# EAGLE design usb_cable_tester (EAGLE 7.7.0)
CNAME: USB Cable Tester (Aroerina2 Mod); CREVISION: 0.1; DESIGNER: drubicza
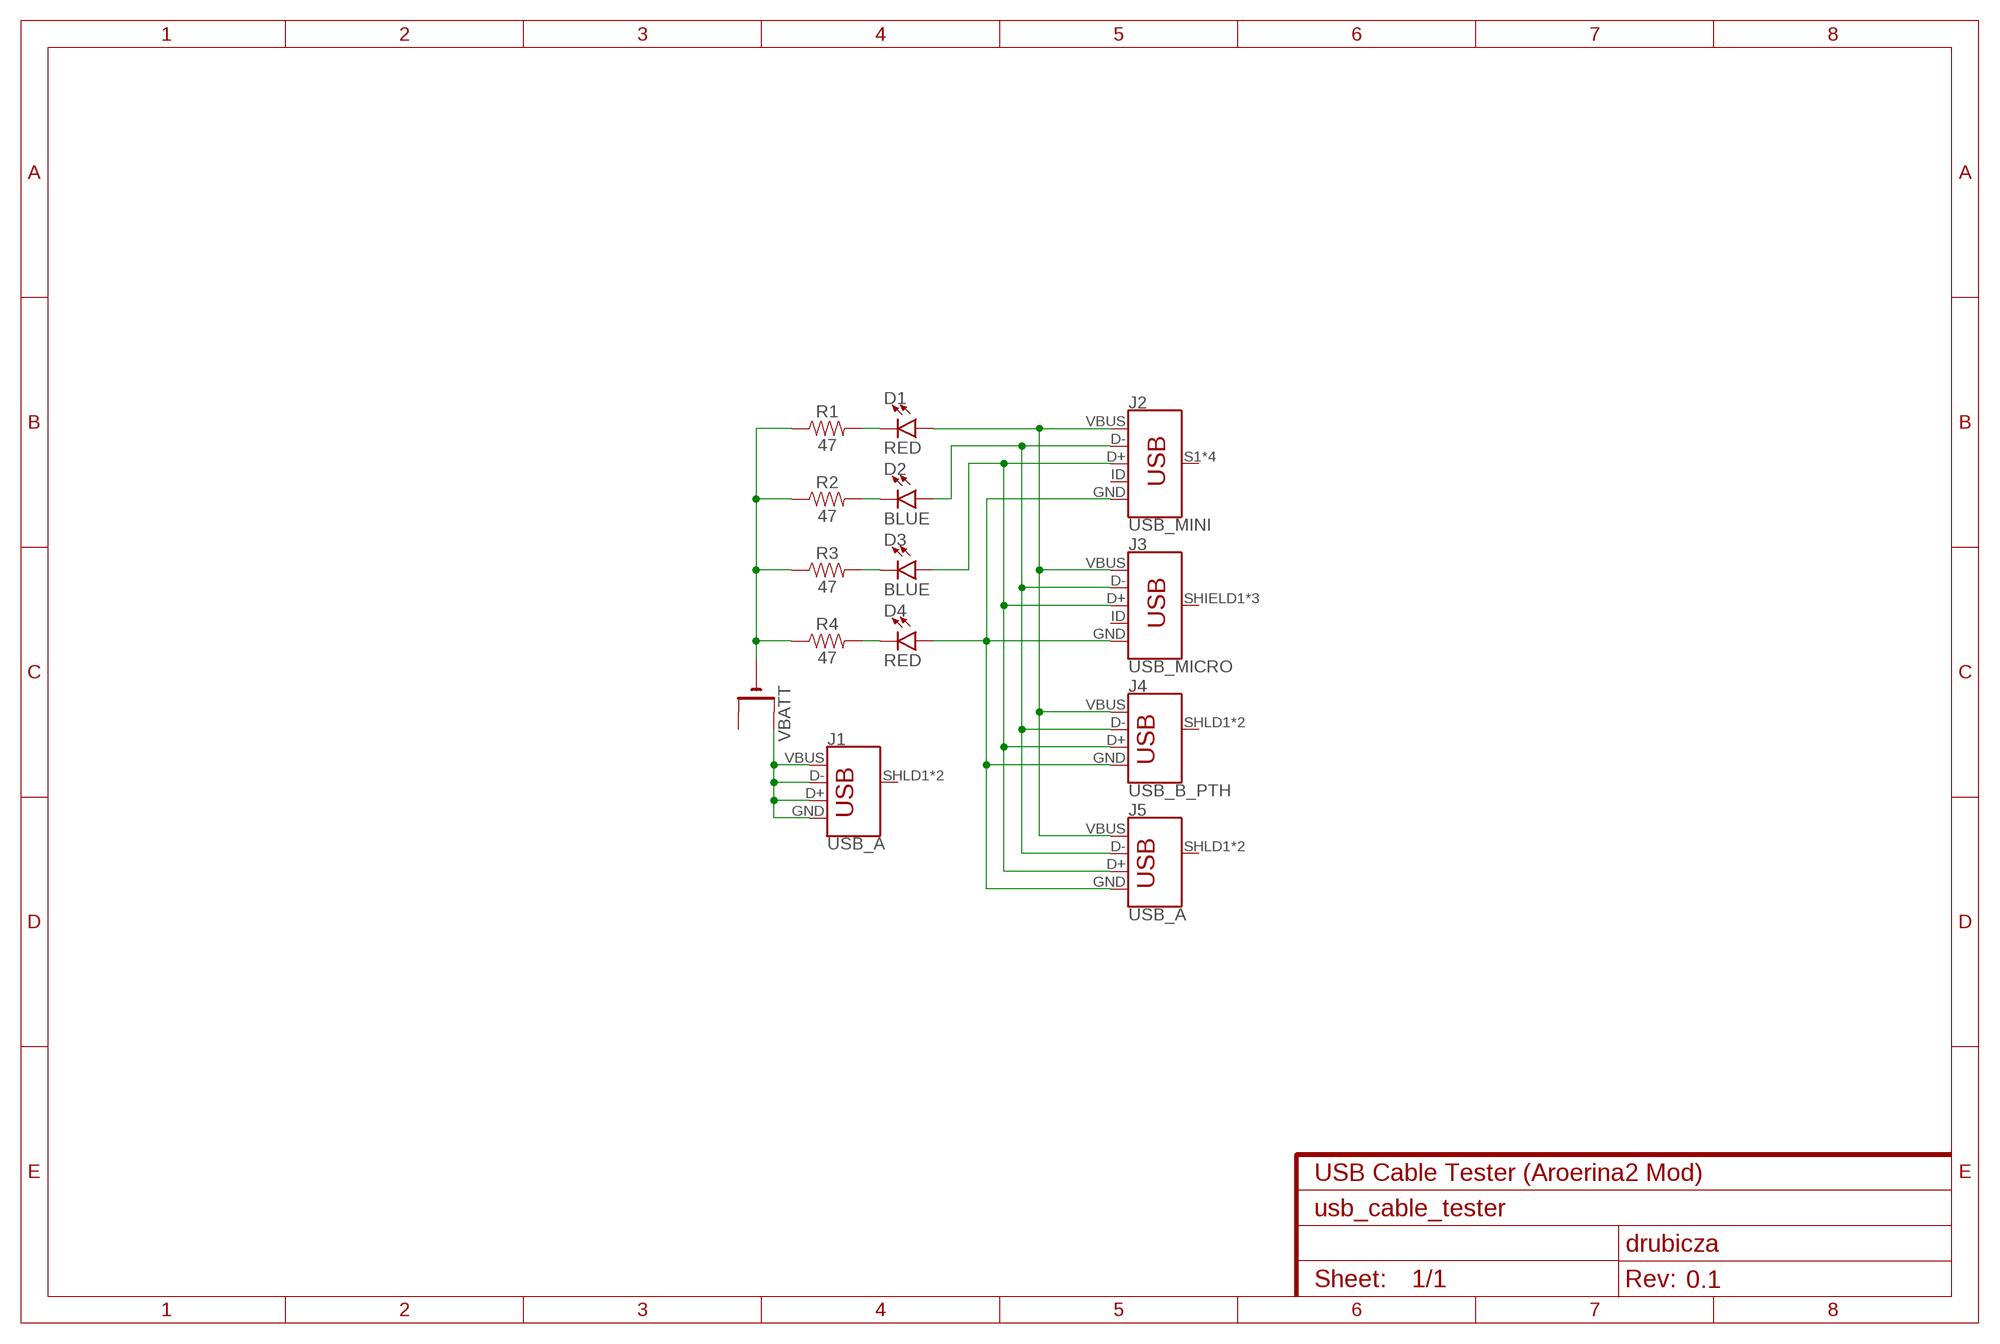
[diagram p0: schematic, sheet 1]

## Parts
D1  RED  LED-RED0603  [LED-0603]
D2  BLUE  LED-BLUE0603  [LED-0603]
D3  BLUE  LED-BLUE0603  [LED-0603]
D4  RED  LED-RED0603  [LED-0603]
J1  USB_A  USB_A_SMT_FEMALE_NS  [USB-A-S-NOSILK-FEMALE]
J2  USB_MINI  USB_MINI-B_SMT  [USB-MINIB]
J3  USB_MICRO  USB_MICRO-B_FEMALE-SMT  [USB-B-MICRO-SMD]
J4  USB_B_PTH  [USB-B-PTH]
J5  USB_A  USB_A_SMT_FEMALE_NS  [USB-A-S-NOSILK-FEMALE]
R1  47  47KOHM-0603-1/10W-1%  [0603]
R2  47  47KOHM-0603-1/10W-1%  [0603]
R3  47  47KOHM-0603-1/10W-1%  [0603]
R4  47  47KOHM-0603-1/10W-1%  [0603]
VBATT  CR2032SMT  [CR2032-SMD]

## Nets
GND: R1.1 R2.1 R3.1 R4.1 VBATT.-
N$1: D1.C R1.2
N$2: D2.C R2.2
N$3: D3.C R3.2
N$4: D4.C R4.2
N$6: J1.D+ J1.D- J1.GND J1.VBUS VBATT.+$1(+)
N$7: D1.A J2.VBUS J3.VBUS J4.VBUS J5.VBUS
N$8: D2.A J2.D- J3.D- J4.D- J5.D-
N$9: D3.A J2.D+ J3.D+ J4.D+ J5.D+
N$10: D4.A J2.GND J3.GND J4.GND J5.GND
Unconnected: J1.SHLD1(SHIELD) J1.SHLD2(SHIELD) J2.ID J2.S1(SHIELD) J2.S2(SHIELD) J2.S3(SHIELD) J2.S4(SHIELD) J3.ID J3.SHIELD1(SHIELD) J3.SHIELD2(SHIELD) J3.SHIELD3(SHIELD) J4.SHLD1(SHIELD) J4.SHLD2(SHIELD) J5.SHLD1(SHIELD) J5.SHLD2(SHIELD) VBATT.+$2(+1)

## Library data of the parts
D1 D4 = SparkFun-LED:LED-RED: Red SMD LED Used in manufacturing of most products at SparkFun Packages: 0603 - SMD 0603 package [Product Link] <http://docs.avagotech.com/docs/AV02-0551EN> 0603 SMART - SMD 0603 SMART package ( more efficient and expensive)[Product Link] <http://www.osram-os.com/Graphics/XPic2/00077099_0.pdf> 1206 - SMD1206 package [Product Link] <https://www.sparkfun.com/datasheets/DevTools/LilyPad/Q150OVS4.pdff> SparkFun Products: Pro Mini 328 -5V <https://www.sparkfun.com/products/821> RedBoard <https://www.sparkfun.com/products/12757> IOIO-OTG <https://www.sparkfun.com/products/13613>; PROD_ID: DIO-00819
D2 D3 = SparkFun-LED:LED-BLUE: Blue SMD LED Used in manufacturing of various products at SparkFun Packages: 0603 - SMD 0603 package [Product Link] <http://www.digikey.com/product-detail/en/SMLE12BC7TT86/511-1589-2-ND/1641808> 1206 - SMD1206 package [Product Link] <http://www.digikey.com/product-detail/en/lite-on-inc/LTST-C150TBKT/160-1643-1-ND/573584> SparkFun Products: ESP8266 Thing-Dev Board <https://www.sparkfun.com/products/13711> RedBoard <https://www.sparkfun.com/products/12757>; PROD_ID: DIO-08575
J1 J5 = SparkFun-Connectors:USB_A: USB-A Connector Male and female variants, as well as PTH and SMT variants SparkFun Products: SparkFun XBee Explorer Dongle <https://www.sparkfun.com/products/11697> PTH Male SparkFun MicroView-USB Programmer <https://www.sparkfun.com/products/12924> SMT Male SparkFun USB Type A Female Breakout <https://www.sparkfun.com/products/12700> SMT Female; PROD_ID: CONN-09520; SF_ID: PRT-09011
J2 = SparkFun-Connectors:USB_MINI-B: USB type Mini-B Connector Breaks out 5th pin, and includes shield pins if needed. SparkFun Products: SparkFun FTDI Basic Breakout <https://www.sparkfun.com/products/9716> SparkFun XBee Explorer USB <https://www.sparkfun.com/products/11812> SparkFun Redboard <https://www.sparkfun.com/products/12757>; PROD_ID: CONN-08193; SF_ID: PRT-00587
J3 = SparkFun-Connectors:USB_MICRO-B: USB Type Micro-B Connector Male/female and PTH/SMT variants SparkFun Products: SparkFun microB USB Breakout <https://www.sparkfun.com/products/12035> SparkFun USB microB Plug Breakout <https://www.sparkfun.com/products/10031> SparkFun ESP8266 Thing <https://www.sparkfun.com/products/13231>; PROD_ID: CONN-11752
J4 = SparkFun-Connectors:USB_B: USB Type B Connector SparkFun Products: SparkFun Stepoko <https://www.sparkfun.com/products/13899> PTH; PROD_ID: CONN-08278; SF_ID: PRT-00139
R1-R4 = SparkFun-Resistors:47KOHM: 47kΩ resistor A resistor is a passive two-terminal electrical component that implements electrical resistance as a circuit element. Resistors act to reduce current flow, and, at the same time, act to lower voltage levels within circuits. - Wikipedia; PROD_ID: RES-07871; VALUE: 47k
VBATT = adafruit:CR2032

## Board
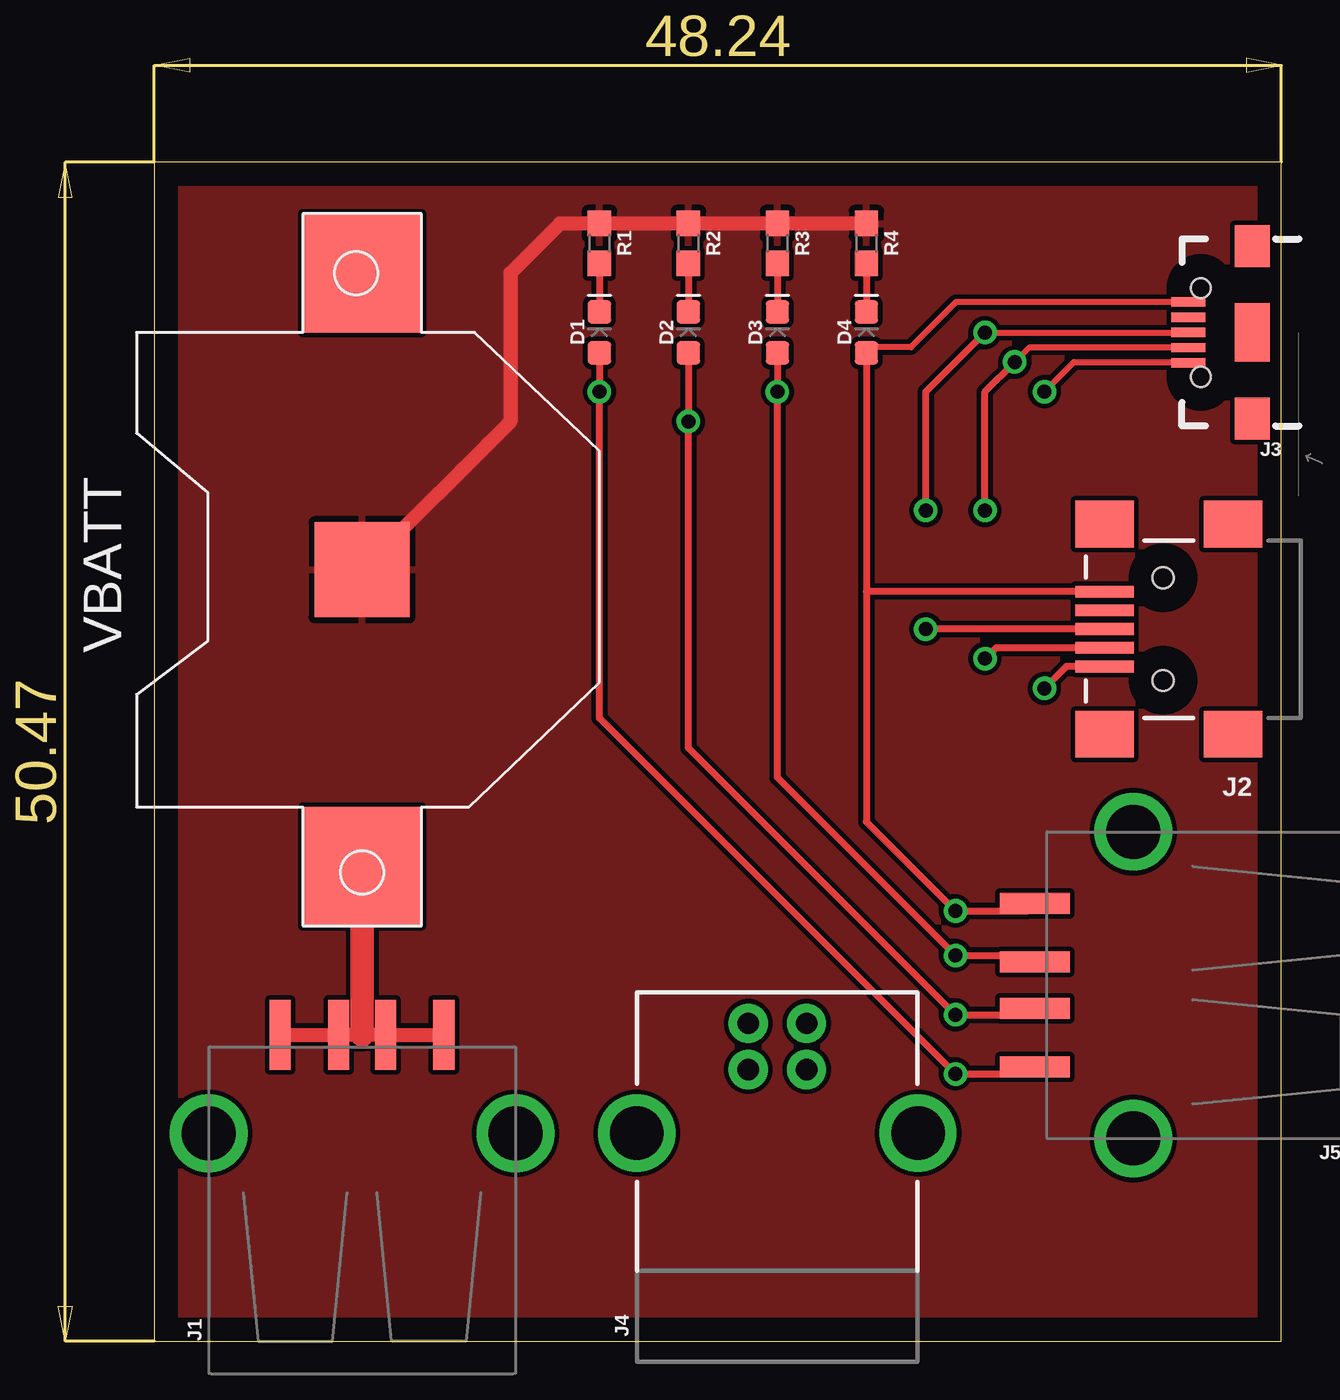
[diagram p1: board, top side]
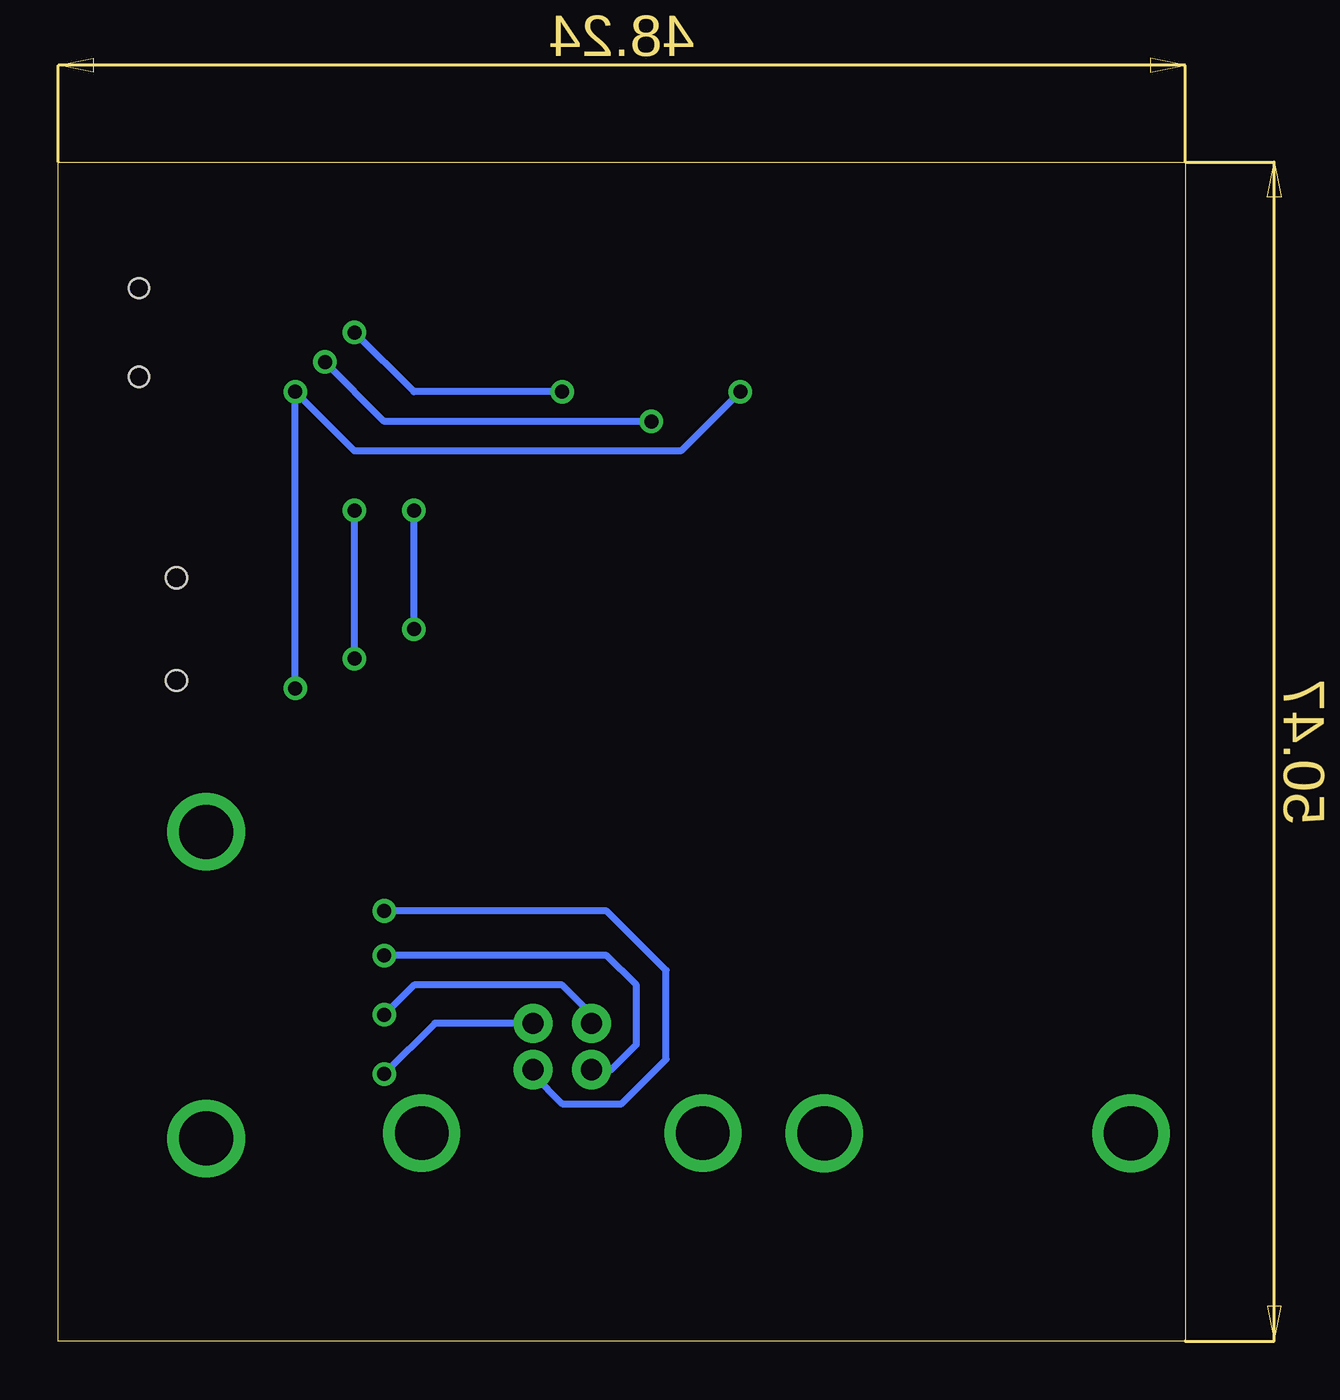
[diagram p2: board, bottom side, seen from below]

Size 48.24 x 50.47 mm. Coordinates in mm from the lower left corner, seen from the top.
Outline: 0,0 48.24,0 48.24,50.47 0,50.47 0,0
Copper layers (1*16): Top 0.035mm / dielectric 1.5mm / Bottom 0.035mm
Design rules "default": minimum track width 10mil, minimum drill 24mil, track to track 8mil, track to pad 8mil, pad to pad 8mil, via to via 8mil, smd to smd 8mil, copper to edge 40mil, drill to drill 8mil, minimum pad ring 10mil, minimum via ring 8mil, stop-mask expansion 4mil, vias tented up to drill 0mil, thermal gap 10mil

### Footprints (pad centres in the part's own frame; a part is rotated, then mirrored left to right if it is on the bottom)
LED-0603 = smd 1 x 1: A -0.877,0; C 0.877,0
USB-A-S-NOSILK-FEMALE = smd 3 x 0.9: D+ 6.752,-1; D- 6.752,1; GND 6.752,-3.5; VBUS 6.752,3.5 | drill 2.311: SHLD1 2.54,-6.566; SHLD2 2.54,6.566
USB-MINIB = smd 2.5 x 0.5: D+ 2.5,0; D- 2.5,0.8; GND 2.5,-1.6; ID 2.5,-0.8; VBUS 2.5,1.6 | smd 2.5 x 2: S1 -3,4.5; S2 2.5,4.5; S3 -3,-4.5; S4 2.5,-4.5 | hole 0.9: 0,2.2; 0,-2.2
USB-B-MICRO-SMD = smd 1.45 x 0.4: D+ 2.725,0; D- 2.725,0.65; GND 2.725,-1.3; ID 2.725,-0.65; VBUS 2.725,1.3 | smd 1.5 x 1.8: SHIELD1 0,3.685; SHIELD2 0,-3.685 | smd 1.5 x 2.5: SHIELD3 0,0 | hole 0.85: 2.2,1.9; 2.2,-1.9
USB-B-PTH = drill 0.914 pad 1.676: D+ 4,1.25; D- 5.981,1.25; GND 4,-1.25; VBUS 5.981,-1.25 | drill 2.286: SHLD1 1.282,-6.02; SHLD2 1.282,6.02
0603 = smd 1.1 x 1: 1 -0.85,0; 2 0.85,0
CR2032-SMD = smd 5.08 x 5.08: +$1 -12.7,0; +$2 12.7,0 | smd 4.064 x 4.064: - 0,0

### Placement (x,y rotation side)
D1  19.05,43.18 90 top
D2  22.86,43.18 90 top
D3  26.67,43.18 90 top
D4  30.48,43.18 90 top
J1  8.89,6.35 90 top
J2  43.18,30.48 180 top
J3  46.99,43.18 180 top
J4  26.67,7.62 90 top
J5  44.45,15.24 180 top
R1  19.05,46.99 270 top
R2  22.86,46.99 270 top
R3  26.67,46.99 270 top
R4  30.48,46.99 270 top
VBATT  8.89,33.02 90 top

### Tracks (layer width: path | path; a pad name or v marks a point on that pad's centre or on a via)
GND
  Top 0.61: R4.1 R3.1 R2.1 R1.1 17.36,47.84 15.24,45.72 15.24,39.37 VBATT.-
  pour Top: 0,0 0,50.16 48.26,50.16 48.26,0
N$1
  Top 0.305: R1.2 D1.C
N$2
  Top 0.305: R2.2 D2.C
N$3
  Top 0.305: R3.2 D3.C
N$4
  Top 0.305: R4.2 D4.C
N$6
  Top 0.61: J1.VBUS J1.D- 8.89,13.1 J1.D+ J1.GND
  Top 1.016: VBATT.+$1 8.89,13.1
N$7  (via drill 0.6)
  Top 0.254: v38.1,40.64 39.37,41.91 44.23,41.91
  Top 0.305: J5.VBUS 37.39,11.43 v34.29,11.43 19.05,26.67 v19.05,40.64 D1.A | 44.23,41.91 J3.VBUS | J2.VBUS 39.04,28.88 v38.1,27.94
  Bottom 0.305: J4.VBUS 32.12,13.6 v34.29,11.43 | v19.05,40.64 21.59,38.1 35.56,38.1 v38.1,40.64 v38.1,27.94
N$8  (via drill 0.6)
  Top 0.254: v36.83,41.91 37.47,42.55 44.25,42.55
  Top 0.305: J5.D- 37.43,13.97 v34.29,13.97 22.86,25.4 v22.86,39.37 D2.A | 44.25,42.55 J3.D- | J2.D- 36.03,29.68 v35.56,29.21 | v35.56,35.56 35.56,40.64 v36.83,41.91
  Bottom 0.305: J4.D- 25.42,13.99 26.67,15.24 33.02,15.24 v34.29,13.97 | v22.86,39.37 34.29,39.37 v36.83,41.91 | v35.56,29.21 v35.56,35.56
N$9  (via drill 0.6)
  Top 0.254: v35.56,43.18 J3.D+
  Top 0.305: J5.D+ 37.43,16.51 v34.29,16.51 26.67,24.13 v26.67,40.64 D3.A | J2.D+ v33.02,30.48 | v33.02,35.56 33.02,40.64 v35.56,43.18
  Bottom 0.305: J4.D+ 24.57,11.62 23.5,12.7 23.5,15.24 24.77,16.51 v34.29,16.51 | v26.67,40.64 33.02,40.64 v35.56,43.18 | v33.02,30.48 v33.02,35.56
N$10  (via drill 0.6)
  Top 0.254: J3.GND 34.32,44.48 32.38,42.55 30.72,42.55
  Top 0.305: J5.GND 37.37,18.41 v34.29,18.41 30.48,22.23 30.48,32.08 | 30.48,32.08 D4.A 30.72,42.55 | J2.GND 30.48,32.08
  Bottom 0.305: J4.GND 27.92,11.41 26.67,10.16 24.13,10.16 22.23,12.06 22.23,15.88 24.77,18.41 v34.29,18.41